# EAGLE schematic m-power-v0 (EAGLE 5.07)
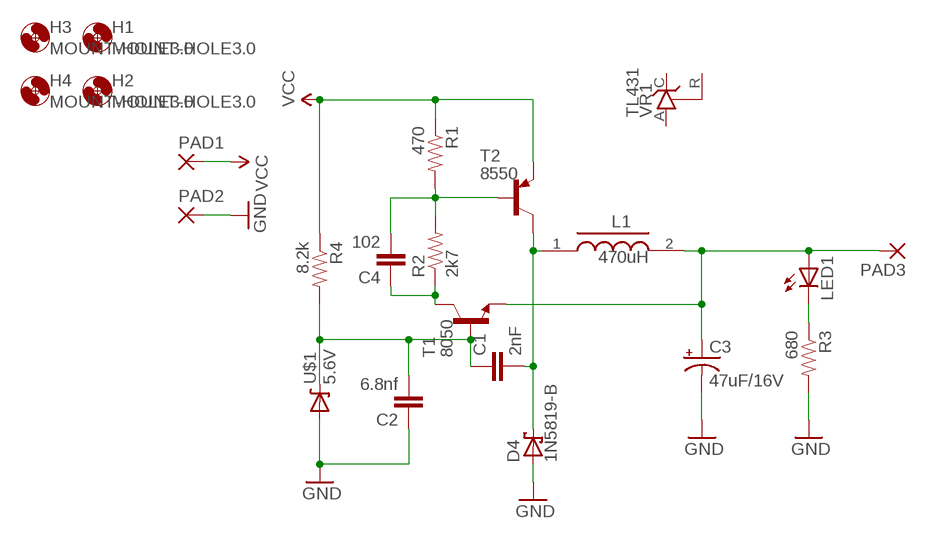
[diagram p0: schematic, sheet 1]

## Parts
C1  2nF  CAPPTH  [CAP-PTH-SMALL]
C2  6.8nf  CAPPTH  [CAP-PTH-SMALL]
C3  47uF/16V  CAP_POLPTH1  [CPOL-RADIAL-100UF-25V]
C4  102  CAPPTH  [CAP-PTH-SMALL]
D4  1N5819-B  [DO41-7.6]
H1  MOUNT-HOLE3.0  [3,0]
H2  MOUNT-HOLE3.0  [3,0]
H3  MOUNT-HOLE3.0  [3,0]
H4  MOUNT-HOLE3.0  [3,0]
L1  470uH  INDUCTOR-IED16  [ED16]
LED1  LED3MM  [LED3MM]
PAD1  3,81/1,3  [3,81/1,3]
PAD2  3,81/1,3  [3,81/1,3]
PAD3  3,81/1,3  [3,81/1,3]
R1  470  RESISTOR1/4W  [AXIAL-0.3]
R2  2k7  RESISTOR1/4W  [AXIAL-0.3]
R3  680  RESISTOR1/4W  [AXIAL-0.3]
R4  8.2k  RESISTOR1/4W  [AXIAL-0.3]
T1  8050  90**-NPN-TO92-EBC  [TO92-EBC]
T2  8550  90**-PNP-TO92-EBC  [TO92-EBC]
U$1  5.6V  DIODE-ZENERPTH  [DIODE-ZENER]
VR1  TL431  TL431CLP  [TO92-CLP]

## Nets
GND: C2.1 C3.2(-) D4.A PAD2.1(P) R3.P$2 U$1.P$2(A)
N$1: C4.2 R1.P$2 R2.P$2 T2.B
N$2: C4.1 R2.P$1 T1.C
N$3: LED1.K(C) R3.P$1
N$5: C3.1(+) L1.2 LED1.A PAD3.1(P) T1.E
N$6: C1.1 C2.2 R4.P$2 T1.B U$1.P$1(C)
N$7: C1.2 D4.C L1.1 T2.C
VCC: PAD1.1(P) R1.P$1 R4.P$1 T2.E
Unconnected: VR1.A VR1.C VR1.R

## Library data of the parts
C1 C2 C4 = digital-toy:CAP: Capacitor Standard 0603 ceramic capacitor, and 0.1" leaded capacitor.
C3 = digital-toy:CAP_POL: Capacitor Polarized These are standard SMD and PTH capacitors. Normally 10uF, 47uF, and 100uF in electrolytic and tantalum varieties. Always verify the external diameter of the through hole cap, it varies with capacity, voltage, and manufacturer. The EIA devices should be standard. PANASONIC_D size: 6.5mmx6.5mmx5.5mm, 100uf (taobao:6.3mmx5.5mm), same as CVL0605 153cvl0405 size: 4mmx4mmx5.5mm, 10uf (taobao:4mmx5.5mm)
D4 = diode:1N581*: 1.0A SCHOTTKY BARRIER RECTIFIER Source: http://www.diodes.com/datasheets/ds23001.pdf
H1-H4 = holes:MOUNT-HOLE: MOUNTING HOLE with drill center marker
L1 = digital-toy:INDUCTOR-I: Inductors with Iron
LED1 = digital-toy:LED: LEDs Standard schematic elements and footprints for 5mm, 3mm, 1206, and 0603 sized LEDs. 5mm - Spark Fun Electronics SKU : COM-00529 (and others)
PAD1-PAD3 = wirepad:3,81/1,3: THROUGH-HOLE PAD
R1-R4 = digital-toy:RESISTOR: Resistor Basic schematic elements and footprints for 0603, 1206, and PTH 1/10th watt (small) resistors.
T1 = digital-toy:*-NPN-: NPN Transistror most of sot-23 use the pacages sot23-BEC, top C, left B, right E. by hyl, digital-toy. and to-92 use ebc(from-top) by hyl, digital-toy.
T2 = digital-toy:*-PNP-: PNP Transistror
U$1 = digital-toy:DIODE-ZENER: Zener Diode Production Part - 8199 3.4V Zener Voltage
VR1 = v-reg:TL431CLP: VOLTAGE REGULATOR